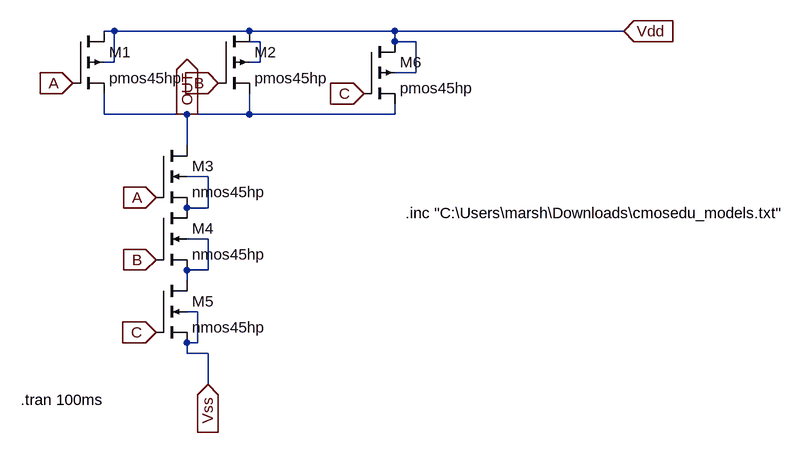
[diagram p0: schematic 3innand2.asc]
3innand2.asc, the LTspice schematic file:
Version 4.1
SHEET 1 1280 712
WIRE 176 64 160 64
WIRE 384 64 176 64
WIRE 608 64 384 64
WIRE 960 64 608 64
WIRE 400 80 384 80
WIRE 608 80 608 64
WIRE 640 80 608 80
WIRE 176 112 176 64
WIRE 176 112 160 112
WIRE 400 112 400 80
WIRE 400 112 384 112
WIRE 640 128 640 80
WIRE 640 128 608 128
WIRE 160 192 160 160
WIRE 288 192 160 192
WIRE 384 192 384 160
WIRE 384 192 288 192
WIRE 608 192 608 176
WIRE 608 192 384 192
WIRE 288 240 288 192
WIRE 320 288 288 288
WIRE 320 336 320 288
WIRE 320 336 288 336
WIRE 320 384 288 384
WIRE 320 432 320 384
WIRE 320 432 288 432
WIRE 288 448 288 432
WIRE 304 496 288 496
WIRE 304 544 304 496
WIRE 304 544 288 544
WIRE 288 560 288 544
WIRE 320 560 288 560
WIRE 320 608 320 560
FLAG 112 144 A
IOPIN 112 144 In
FLAG 240 320 A
IOPIN 240 320 In
FLAG 336 144 B
IOPIN 336 144 In
FLAG 240 416 B
IOPIN 240 416 In
FLAG 288 192 OUT
IOPIN 288 192 Out
FLAG 560 160 C
IOPIN 560 160 In
FLAG 240 528 C
IOPIN 240 528 In
FLAG 960 64 Vdd
IOPIN 960 64 In
FLAG 320 608 Vss
IOPIN 320 608 In
SYMBOL pmos4 112 64 R0
SYMATTR InstName M1
SYMATTR Value pmos45hp
SYMATTR Value2 l=100n w=300n
SYMBOL pmos4 336 64 R0
SYMATTR InstName M2
SYMATTR Value pmos45hp
SYMATTR Value2 l=100n w=300n
SYMBOL nmos4 240 240 R0
SYMATTR InstName M3
SYMATTR Value nmos45hp
SYMATTR Value2 l=100n w=600n
SYMBOL nmos4 240 336 R0
SYMATTR InstName M4
SYMATTR Value nmos45hp
SYMATTR Value2 l=100n w=600n
SYMBOL nmos4 240 448 R0
SYMATTR InstName M5
SYMATTR Value nmos45hp
SYMATTR Value2 l=100n w=600n
SYMBOL pmos4 560 80 R0
SYMATTR InstName M6
SYMATTR Value pmos45hp
SYMATTR Value2 l=100n w=300n
TEXT 624 344 Left 2 !.inc "C:\\Users\\marsh\\Downloads\\cmosedu_models.txt"
TEXT 32 632 Left 2 !.tran 100ms

The netlist it stands for:
* 3innand2.asc
M1 Vdd A OUT Vdd pmos45hp l=100n w=300n
M2 Vdd B OUT N001 pmos45hp l=100n w=300n
M3 OUT A N002 N002 nmos45hp l=100n w=600n
M4 N002 B N003 N003 nmos45hp l=100n w=600n
M5 N003 C Vss Vss nmos45hp l=100n w=600n
M6 Vdd C OUT Vdd pmos45hp l=100n w=300n
.model NMOS NMOS
.model PMOS PMOS
.lib standard.mos
.inc "C:\Users\marsh\Downloads\cmosedu_models.txt"
.tran 100ms
.backanno
.end